# EAGLE design interface (EAGLE 7.5.0)
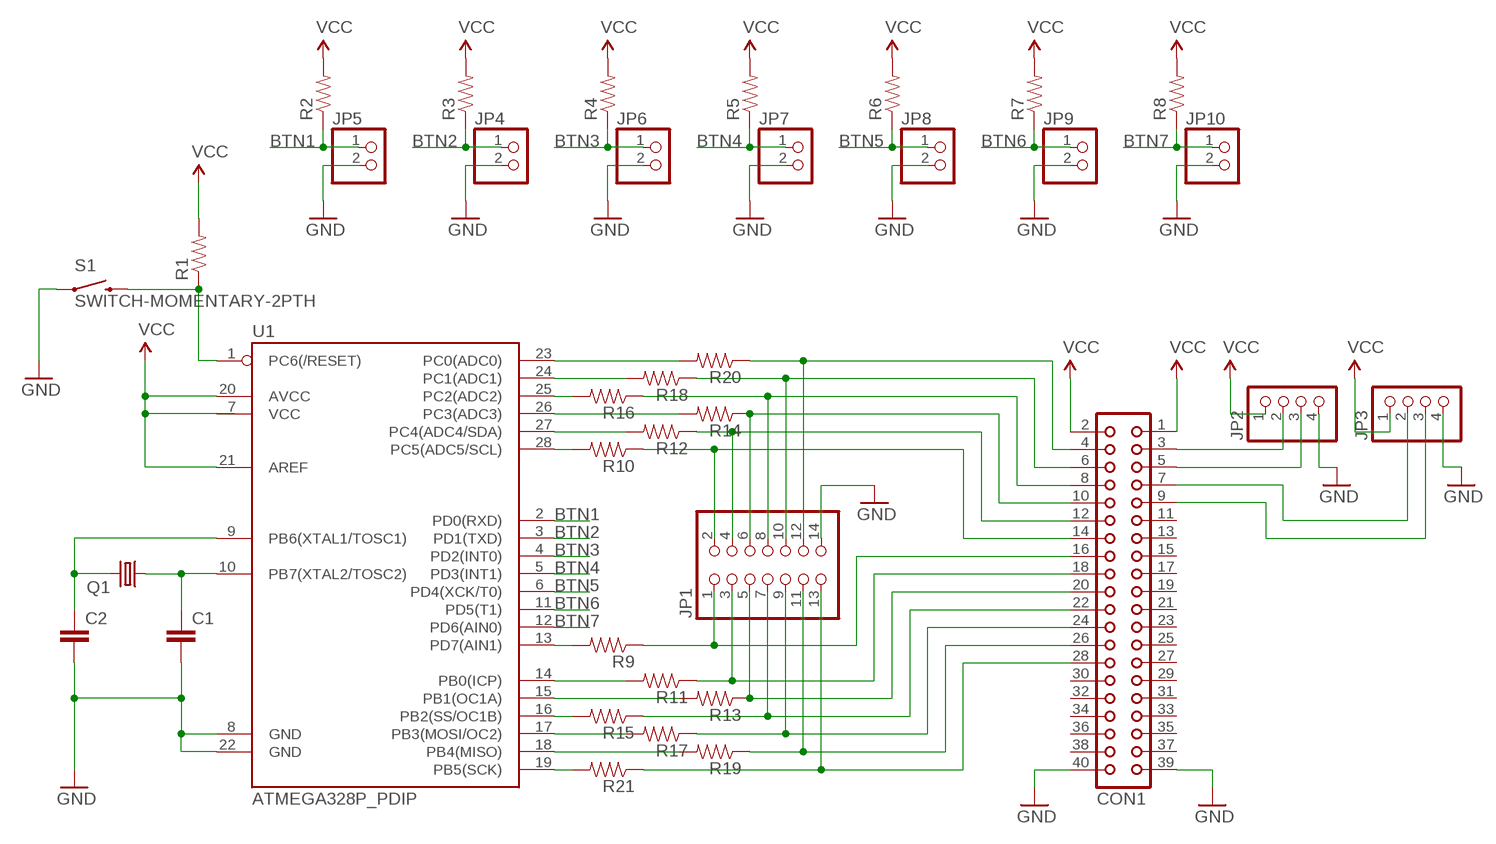
[diagram p0: schematic, sheet 1]

## Parts
C1  CAPPTH  [CAP-PTH-SMALL]
C2  CAPPTH  [CAP-PTH-SMALL]
CON1  CON40  [CON40]
JP1  PINHD-2X7  [2X07]
JP2  PINHD-1X4  [1X04]
JP3  PINHD-1X4  [1X04]
JP4  PINHD-1X2  [1X02]
JP5  PINHD-1X2  [1X02]
JP6  PINHD-1X2  [1X02]
JP7  PINHD-1X2  [1X02]
JP8  PINHD-1X2  [1X02]
JP9  PINHD-1X2  [1X02]
JP10  PINHD-1X2  [1X02]
Q1  CRYSTALHC49S  [HC49/S]
R1  RESISTORPTH-1/4W  [AXIAL-0.4]
R2  RESISTORPTH-1/4W  [AXIAL-0.4]
R3  RESISTORPTH-1/4W  [AXIAL-0.4]
R4  RESISTORPTH-1/4W  [AXIAL-0.4]
R5  RESISTORPTH-1/4W  [AXIAL-0.4]
R6  RESISTORPTH-1/4W  [AXIAL-0.4]
R7  RESISTORPTH-1/4W  [AXIAL-0.4]
R8  RESISTORPTH-1/4W  [AXIAL-0.4]
R9  RESISTORPTH-1/4W  [AXIAL-0.4]
R10  RESISTORPTH-1/4W  [AXIAL-0.4]
R11  RESISTORPTH-1/4W  [AXIAL-0.4]
R12  RESISTORPTH-1/4W  [AXIAL-0.4]
R13  RESISTORPTH-1/4W  [AXIAL-0.4]
R14  RESISTORPTH-1/4W  [AXIAL-0.4]
R15  RESISTORPTH-1/4W  [AXIAL-0.4]
R16  RESISTORPTH-1/4W  [AXIAL-0.4]
R17  RESISTORPTH-1/4W  [AXIAL-0.4]
R18  RESISTORPTH-1/4W  [AXIAL-0.4]
R19  RESISTORPTH-1/4W  [AXIAL-0.4]
R20  RESISTORPTH-1/4W  [AXIAL-0.4]
R21  RESISTORPTH-1/4W  [AXIAL-0.4]
S1  SWITCH-MOMENTARY-2PTH  [TACTILE-PTH]
U1  ATMEGA328P_PDIP  [DIL28-3]

## Nets
BTN1: JP5.1 R2.P$1 U1.2(PD0(RXD))
BTN2: JP4.1 R3.P$1 U1.3(PD1(TXD))
BTN3: JP6.1 R4.P$1 U1.4(PD2(INT0))
BTN4: JP7.1 R5.P$1 U1.5(PD3(INT1))
BTN5: JP8.1 R6.P$1 U1.6(PD4(XCK/T0))
BTN6: JP9.1 R7.P$1 U1.11(PD5(T1))
BTN7: JP10.1 R8.P$1 U1.12(PD6(AIN0))
GND: C1.2 C2.2 CON1.39 CON1.40 JP1.14 JP2.4 JP3.4 JP4.2 JP5.2 JP6.2 JP7.2 JP8.2 JP9.2 JP10.2 S1.1 U1.8(GND) U1.22(GND)
N$1: C1.1 Q1.1 U1.10(PB7(XTAL2/TOSC2))
N$2: C2.1 Q1.2 U1.9(PB6(XTAL1/TOSC1))
N$3: R1.P$1 S1.3 U1.1(PC6(/RESET))
N$4: R9.P$2 U1.13(PD7(AIN1))
N$5: CON1.16 JP1.1 R9.P$1
N$6: R11.P$2 U1.14(PB0(ICP))
N$7: CON1.18 JP1.3 R11.P$1
N$8: CON1.20 JP1.5 R13.P$1
N$9: R13.P$2 U1.15(PB1(OC1A))
N$10: R15.P$2 U1.16(PB2(SS/OC1B))
N$11: CON1.22 JP1.7 R15.P$1
N$12: CON1.24 JP1.9 R17.P$1
N$13: R17.P$2 U1.17(PB3(MOSI/OC2))
N$14: R19.P$2 U1.18(PB4(MISO))
N$15: R21.P$2 U1.19(PB5(SCK))
N$16: CON1.28 JP1.13 R21.P$1
N$17: CON1.7 JP3.2
N$18: CON1.9 JP3.3
N$19: CON1.5 JP2.3
N$20: CON1.3 JP2.2
N$21: CON1.26 JP1.11 R19.P$1
N$22: R10.P$2 U1.28(PC5(ADC5/SCL))
N$23: CON1.14 JP1.2 R10.P$1
N$24: R12.P$2 U1.27(PC4(ADC4/SDA))
N$25: CON1.12 JP1.4 R12.P$1
N$26: R14.P$2 U1.26(PC3(ADC3))
N$27: CON1.10 JP1.6 R14.P$1
N$28: R16.P$2 U1.25(PC2(ADC2))
N$29: CON1.8 JP1.8 R16.P$1
N$30: R18.P$2 U1.24(PC1(ADC1))
N$31: CON1.6 JP1.10 R18.P$1
N$32: R20.P$2 U1.23(PC0(ADC0))
N$33: CON1.4 JP1.12 R20.P$1
VCC: CON1.1 CON1.2 JP2.1 JP3.1 R1.P$2 R2.P$2 R3.P$2 R4.P$2 R5.P$2 R6.P$2 R7.P$2 R8.P$2 U1.20(AVCC) U1.21(AREF)
Unconnected: CON1.11 CON1.13 CON1.15 CON1.17 CON1.19 CON1.21 CON1.23 CON1.25 CON1.27 CON1.29 CON1.30 CON1.31 CON1.32 CON1.33 CON1.34 CON1.35 CON1.36 CON1.37 CON1.38 U1.7(VCC)

## Library data of the parts
C1 C2 = SparkFun-Capacitors:CAP: Capacitor Standard 0603 ceramic capacitor, and 0.1" leaded capacitor.
CON1 = con-harting:CON40: CONNECTOR; OC_FARNELL: unknown; OC_NEWARK: unknown
JP1 = pinhead:PINHD-2X7: PIN HEADER
JP2 JP3 = pinhead:PINHD-1X4: PIN HEADER
JP4-JP10 = pinhead:PINHD-1X2: PIN HEADER
Q1 = crystal:CRYSTAL: CRYSTAL; OC_FARNELL: 1667008; OC_NEWARK: unknown
R1-R21 = SparkFun-Passives:RESISTOR: Resistor Basic schematic elements and footprints for 0603, 1206, and PTH resistors.
S1 = SparkFun-Electromechanical:SWITCH-MOMENTARY-2: Various NO switches- pushbuttons, reed, etc; PROD_ID: SWCH-08441
U1 = SparkFun-DigitalIC:ATMEGA328P_PDIP: uC used in the Arduino 32kb flash, 1k EEPROM, 2k SRAM This is the through-hole version of this chip.

## Board
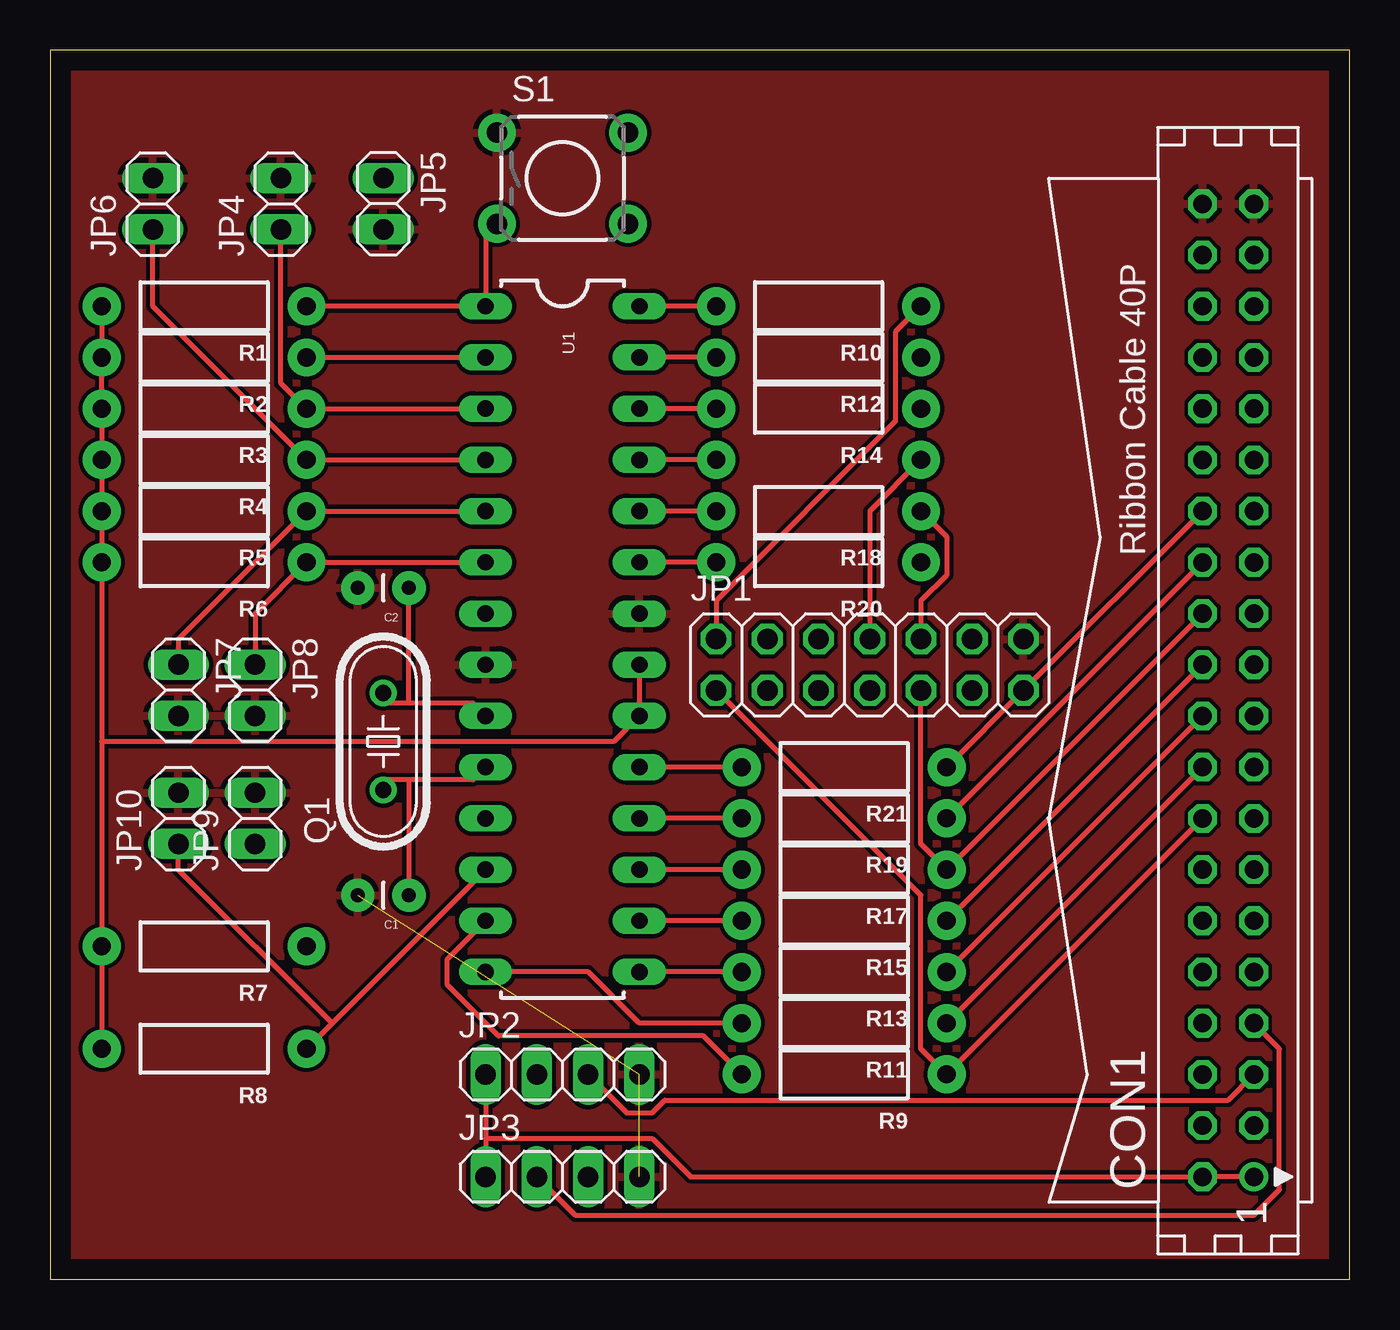
[diagram p1: board, top side]
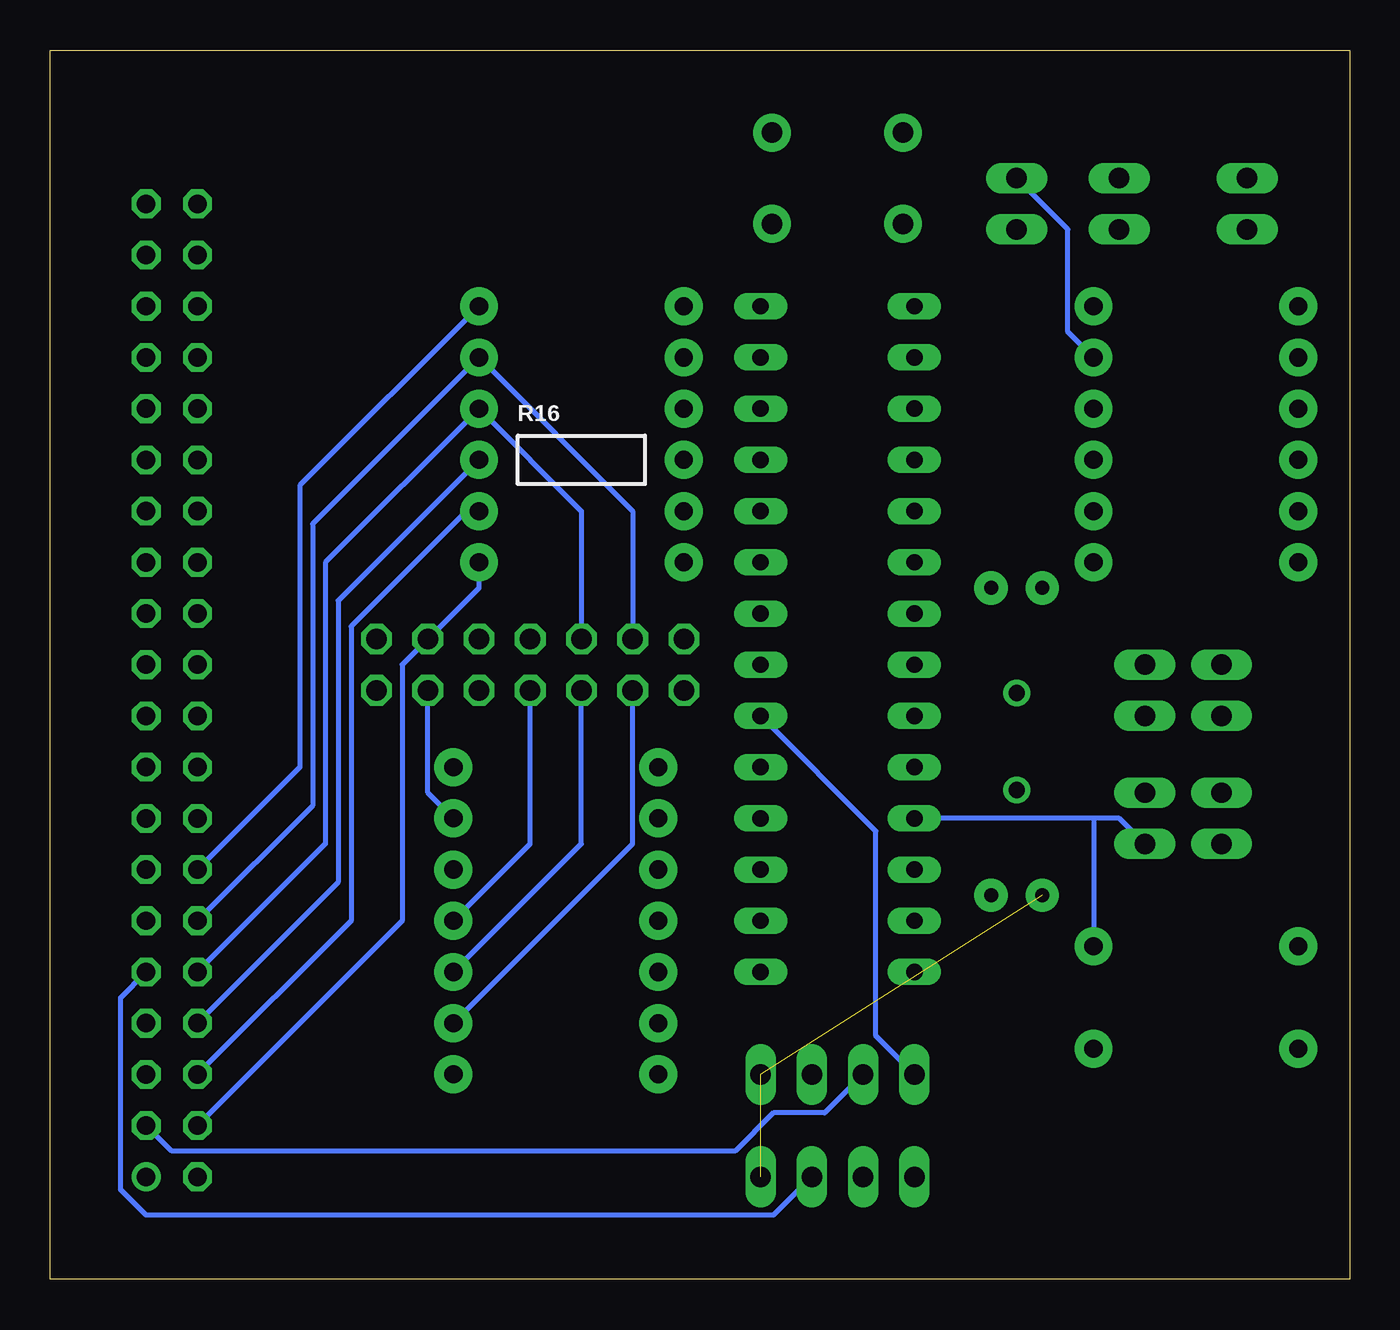
[diagram p2: board, bottom side, seen from below]

Size 64.44 x 60.95 mm. Coordinates in mm from the lower left corner, seen from the top.
Outline: 0,0 64.44,0 64.44,60.95 0,60.95 0,0
Copper layers (1*16): Top 0.035mm / dielectric 1.5mm / Bottom 0.035mm
Design rules "default": minimum track width 10mil, minimum drill 24mil, track to track 8mil, track to pad 8mil, pad to pad 8mil, via to via 8mil, smd to smd 8mil, copper to edge 40mil, drill to drill 8mil, minimum pad ring 10mil, minimum via ring 8mil, stop-mask expansion 4mil, vias tented up to drill 0mil, thermal gap 10mil

### Footprints (pad centres in the part's own frame; a part is rotated, then mirrored left to right if it is on the bottom)
CAP-PTH-SMALL = drill 0.7 pad 1.651: 1 0,0; 2 2.54,0
CON40 = drill 0.914: 1 -24.13,-1.27 | drill 0.914 octagon: 2 -24.13,1.27; 3 -21.59,-1.27; 4 -21.59,1.27; 5 -19.05,-1.27; 6 -19.05,1.27; 7 -16.51,-1.27; 8 -16.51,1.27; 9 -13.97,-1.27; 10 -13.97,1.27; 11 -11.43,-1.27; 12 -11.43,1.27; 13 -8.89,-1.27; 14 -8.89,1.27; 15 -6.35,-1.27; 16 -6.35,1.27; 17 -3.81,-1.27; 18 -3.81,1.27; 19 -1.27,-1.27; 20 -1.27,1.27; 21 1.27,-1.27; 22 1.27,1.27; 23 3.81,-1.27; 24 3.81,1.27; 25 6.35,-1.27; 26 6.35,1.27; 27 8.89,-1.27; 28 8.89,1.27; 29 11.43,-1.27; 30 11.43,1.27; 31 13.97,-1.27; 32 13.97,1.27; 33 16.51,-1.27; 34 16.51,1.27; 35 19.05,-1.27; 36 19.05,1.27; 37 21.59,-1.27; 38 21.59,1.27; 39 24.13,-1.27; 40 24.13,1.27
2X07 = drill 1.016 octagon: 1 -7.62,-1.27; 2 -7.62,1.27; 3 -5.08,-1.27; 4 -5.08,1.27; 5 -2.54,-1.27; 6 -2.54,1.27; 7 0,-1.27; 8 0,1.27; 9 2.54,-1.27; 10 2.54,1.27; 11 5.08,-1.27; 12 5.08,1.27; 13 7.62,-1.27; 14 7.62,1.27
1X04 = drill 1.016 long: 1 -3.81,0; 2 -1.27,0; 3 1.27,0; 4 3.81,0
1X02 = drill 1.016 long: 1 -1.27,0; 2 1.27,0
HC49/S = drill 0.813: 1 -2.413,0; 2 2.413,0
AXIAL-0.4 = drill 0.9 pad 1.88: P$1 -5.08,0; P$2 5.08,0
TACTILE-PTH = drill 1.016 pad 1.88: 1 -3.251,2.261; 2 3.251,2.261; 3 -3.251,-2.261; 4 3.251,-2.261
DIL28-3 = drill 0.813 long: 1 -16.51,-3.81; 2 -13.97,-3.81; 3 -11.43,-3.81; 4 -8.89,-3.81; 5 -6.35,-3.81; 6 -3.81,-3.81; 7 -1.27,-3.81; 8 1.27,-3.81; 9 3.81,-3.81; 10 6.35,-3.81; 11 8.89,-3.81; 12 11.43,-3.81; 13 13.97,-3.81; 14 16.51,-3.81; 15 16.51,3.81; 16 13.97,3.81; 17 11.43,3.81; 18 8.89,3.81; 19 6.35,3.81; 20 3.81,3.81; 21 1.27,3.81; 22 -1.27,3.81; 23 -3.81,3.81; 24 -6.35,3.81; 25 -8.89,3.81; 26 -11.43,3.81; 27 -13.97,3.81; 28 -16.51,3.81

### Placement (x,y rotation side)
C1  17.78,19.05 180 top
C2  17.78,34.29 180 top
CON1  58.42,29.21 90 top
JP1  40.64,30.48 0 top
JP2  25.4,10.16 0 top
JP3  25.4,5.08 0 top
JP4  11.43,53.34 90 top
JP5  16.51,53.34 270 top
JP6  5.08,53.34 90 top
JP7  6.35,29.21 270 top
JP8  10.16,29.21 270 top
JP9  10.16,22.86 90 top
JP10  6.35,22.86 90 top
Q1  16.51,26.67 90 top
R1  7.62,48.26 180 top
R2  7.62,45.72 180 top
R3  7.62,43.18 180 top
R4  7.62,40.64 180 top
R5  7.62,38.1 180 top
R6  7.62,35.56 180 top
R7  7.62,16.51 180 top
R8  7.62,11.43 180 top
R9  39.37,10.16 180 top
R10  38.1,48.26 180 top
R11  39.37,12.7 180 top
R12  38.1,45.72 180 top
R13  39.37,15.24 180 top
R14  38.1,43.18 180 top
R15  39.37,17.78 180 top
R16  38.1,40.64 0 bottom
R17  39.37,20.32 180 top
R18  38.1,38.1 180 top
R19  39.37,22.86 180 top
R20  38.1,35.56 180 top
R21  39.37,25.4 180 top
S1  25.4,54.61 0 top
U1  25.4,31.75 270 top

### Tracks (layer width: path | path; a pad name or v marks a point on that pad's centre or on a via)
BTN1
  Top 0.254: R2.P$1 U1.2
  Bottom 0.254: JP5.1 13.97,52.07 13.97,46.99 R2.P$1
BTN2
  Top 0.254: U1.3 R3.P$1 11.43,44.45 JP4.1
BTN3
  Top 0.254: U1.4 R4.P$1 5.08,48.26 JP6.1
BTN4
  Top 0.254: U1.5 R5.P$1 6.35,31.75 JP7.1
BTN5
  Top 0.254: U1.6 R6.P$1 10.16,33.02 JP8.1
BTN6
  Bottom 0.254: 12.7,22.86 11.43,22.86 JP9.1 | 12.7,22.86 U1.11 | 12.7,22.86 R7.P$1
BTN7
  Top 0.254: R8.P$1 13.97,12.7 | 13.97,12.7 U1.12 | JP10.1 6.35,20.32 13.97,12.7
GND  (2 unrouted)
  pour Top: 0,60.96 63.5,60.96 63.5,0 0,0
N$1
  Top 0.254: 17.78,24.77 20.95,24.77 U1.10 | 17.78,24.77 16.51,24.77 Q1.1 | 17.78,24.77 C1.1
N$2
  Top 0.254: 17.78,28.57 20.95,28.57 U1.9 | 17.78,28.57 16.51,28.57 Q1.2 | 17.78,28.57 C2.1
N$3
  Top 0.254: S1.3 21.59,52.07 U1.1 R1.P$1
N$4
  Top 0.254: U1.13 19.68,15.88 19.68,14.61 22.23,12.06 32.38,12.06 R9.P$2
N$5
  Top 0.254: CON1.16 R9.P$1 43.18,11.43 43.18,19.05 JP1.1
N$6
  Top 0.254: U1.14 26.67,15.24 29.21,12.7 R11.P$2
N$7
  Top 0.254: R11.P$1 CON1.18
  Bottom 0.254: JP1.3 35.56,21.59 R11.P$1
N$8
  Top 0.254: R13.P$1 CON1.20
  Bottom 0.254: JP1.5 38.1,21.59 R13.P$1
N$9
  Top 0.254: R13.P$2 U1.15
N$10
  Top 0.254: R15.P$2 U1.16
N$11
  Top 0.254: R15.P$1 CON1.22
  Bottom 0.254: JP1.7 40.64,21.59 R15.P$1
N$12
  Top 0.254: CON1.24 R17.P$1 43.18,21.59 JP1.9
N$13
  Top 0.254: R17.P$2 U1.17
N$14
  Top 0.254: R19.P$2 U1.18
N$15
  Top 0.254: R21.P$2 U1.19
N$16
  Top 0.254: CON1.28 JP1.13 R21.P$1
N$17
  Top 0.254: CON1.7 60.96,11.43 60.96,4.45 59.69,3.17 26.04,3.17 JP3.2
N$18
  Bottom 0.254: CON1.9 60.96,13.97 60.96,4.45 59.69,3.17 28.57,3.17 JP3.3
N$19
  Top 0.254: CON1.5 58.42,8.89 30.48,8.89 29.84,8.26 28.57,8.26 JP2.3
N$20
  Bottom 0.254: CON1.3 58.42,6.35 30.48,6.35 28.57,8.26 26.04,8.26 JP2.2
N$21
  Top 0.254: R19.P$1 CON1.26
  Bottom 0.254: JP1.11 45.72,24.13 R19.P$1
N$22
  Top 0.254: R10.P$2 U1.28
N$23
  Top 0.254: JP1.2 33.02,33.66 41.91,42.55 41.91,46.99 R10.P$1
  Bottom 0.254: CON1.14 52.07,25.4 52.07,39.37 R10.P$1
N$24
  Top 0.254: R12.P$2 U1.27
N$25
  Bottom 0.254: CON1.12 51.44,23.5 51.44,37.47 R12.P$1 35.56,38.1 JP1.4
N$26
  Top 0.254: R14.P$2 U1.26
N$27
  Bottom 0.254: CON1.10 50.8,21.59 50.8,35.56 R14.P$1 38.1,38.1 JP1.6
N$28
  Top 0.254: R16.P$2 U1.25
N$29
  Top 0.254: JP1.8 40.64,38.1 R16.P$1
  Bottom 0.254: CON1.8 50.16,19.68 50.16,33.66 R16.P$1
N$30
  Top 0.254: R18.P$2 U1.24
N$31
  Top 0.254: JP1.10 43.18,33.66 44.45,34.92 44.45,36.83 R18.P$1
  Bottom 0.254: CON1.6 49.53,17.78 49.53,32.38 43.81,38.1 R18.P$1
N$32
  Top 0.254: R20.P$2 U1.23
N$33
  Bottom 0.254: CON1.4 46.99,17.78 46.99,30.48 JP1.12 43.18,34.29 R20.P$1
VCC
  Top 0.254: R8.P$2 R7.P$2 2.54,26.67 | R1.P$2 R2.P$2 R3.P$2 R4.P$2 R5.P$2 R6.P$2 2.54,26.67 | CON1.1 CON1.2 31.75,5.08 29.84,6.99 21.59,6.99 | U1.21 U1.20 27.94,26.67 2.54,26.67 | JP2.1 21.59,6.99 | 21.59,6.99 JP3.1
  Bottom 0.254: U1.20 23.5,22.23 23.5,12.06 JP2.1